# Altium schematic sheet SYSTEM_INTERFACE.SchDoc
size 594 x 420 mm; SheetNumber: 19; SheetTotal: 20
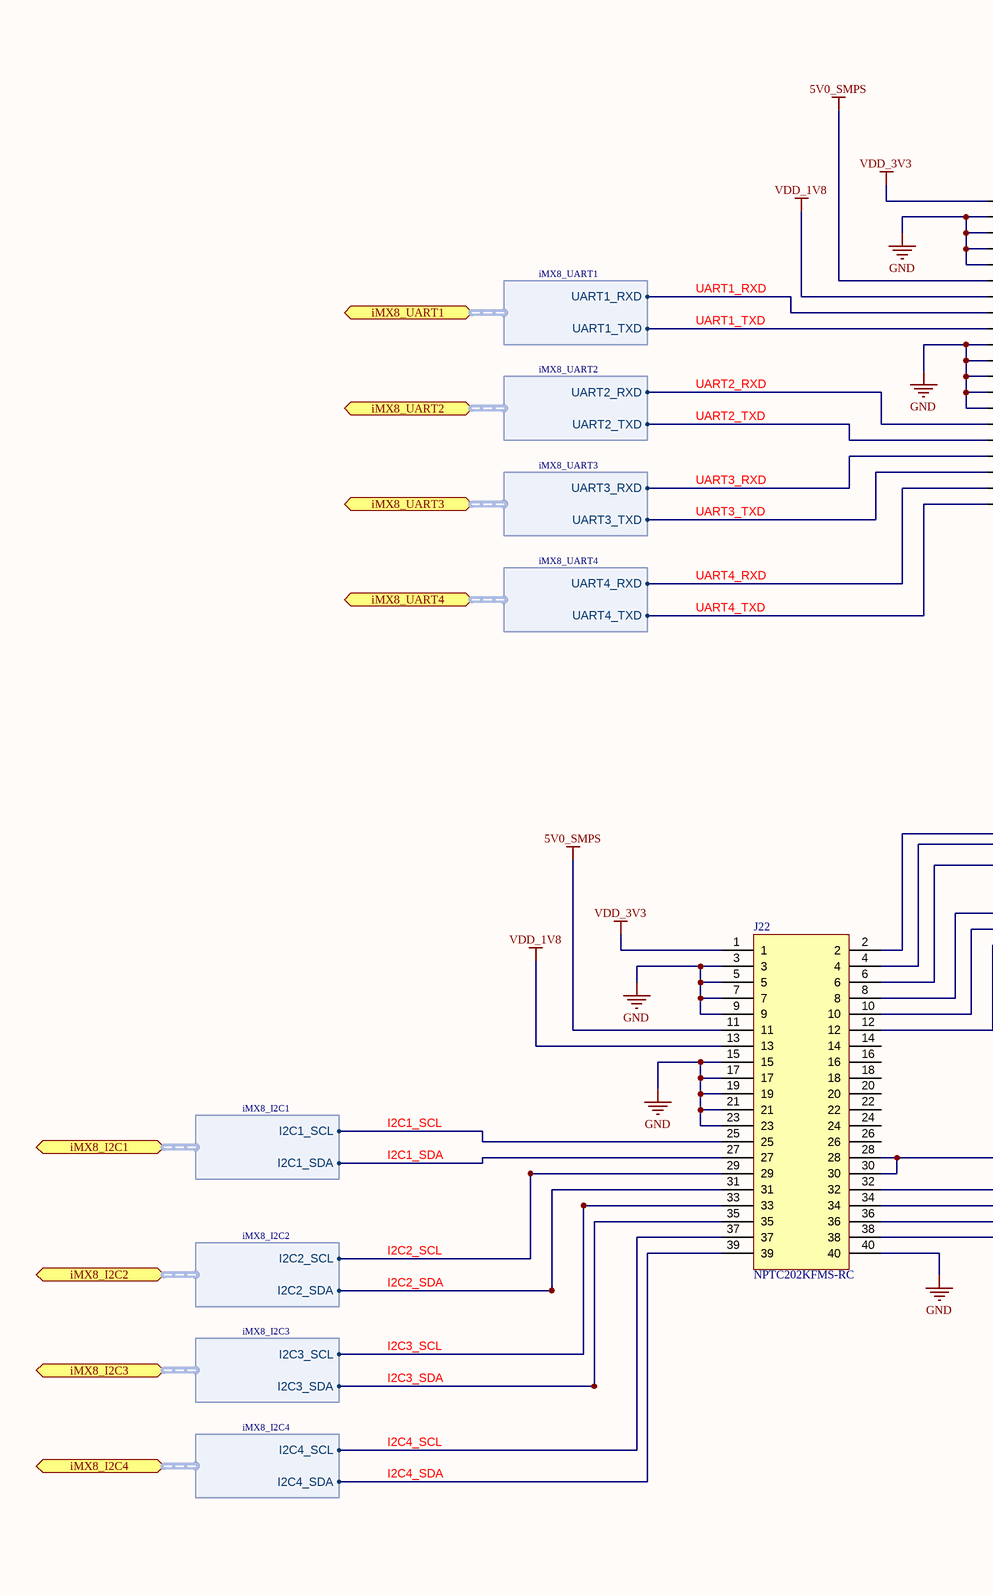
[diagram p0: SYSTEM_INTERFACE.SchDoc, left]
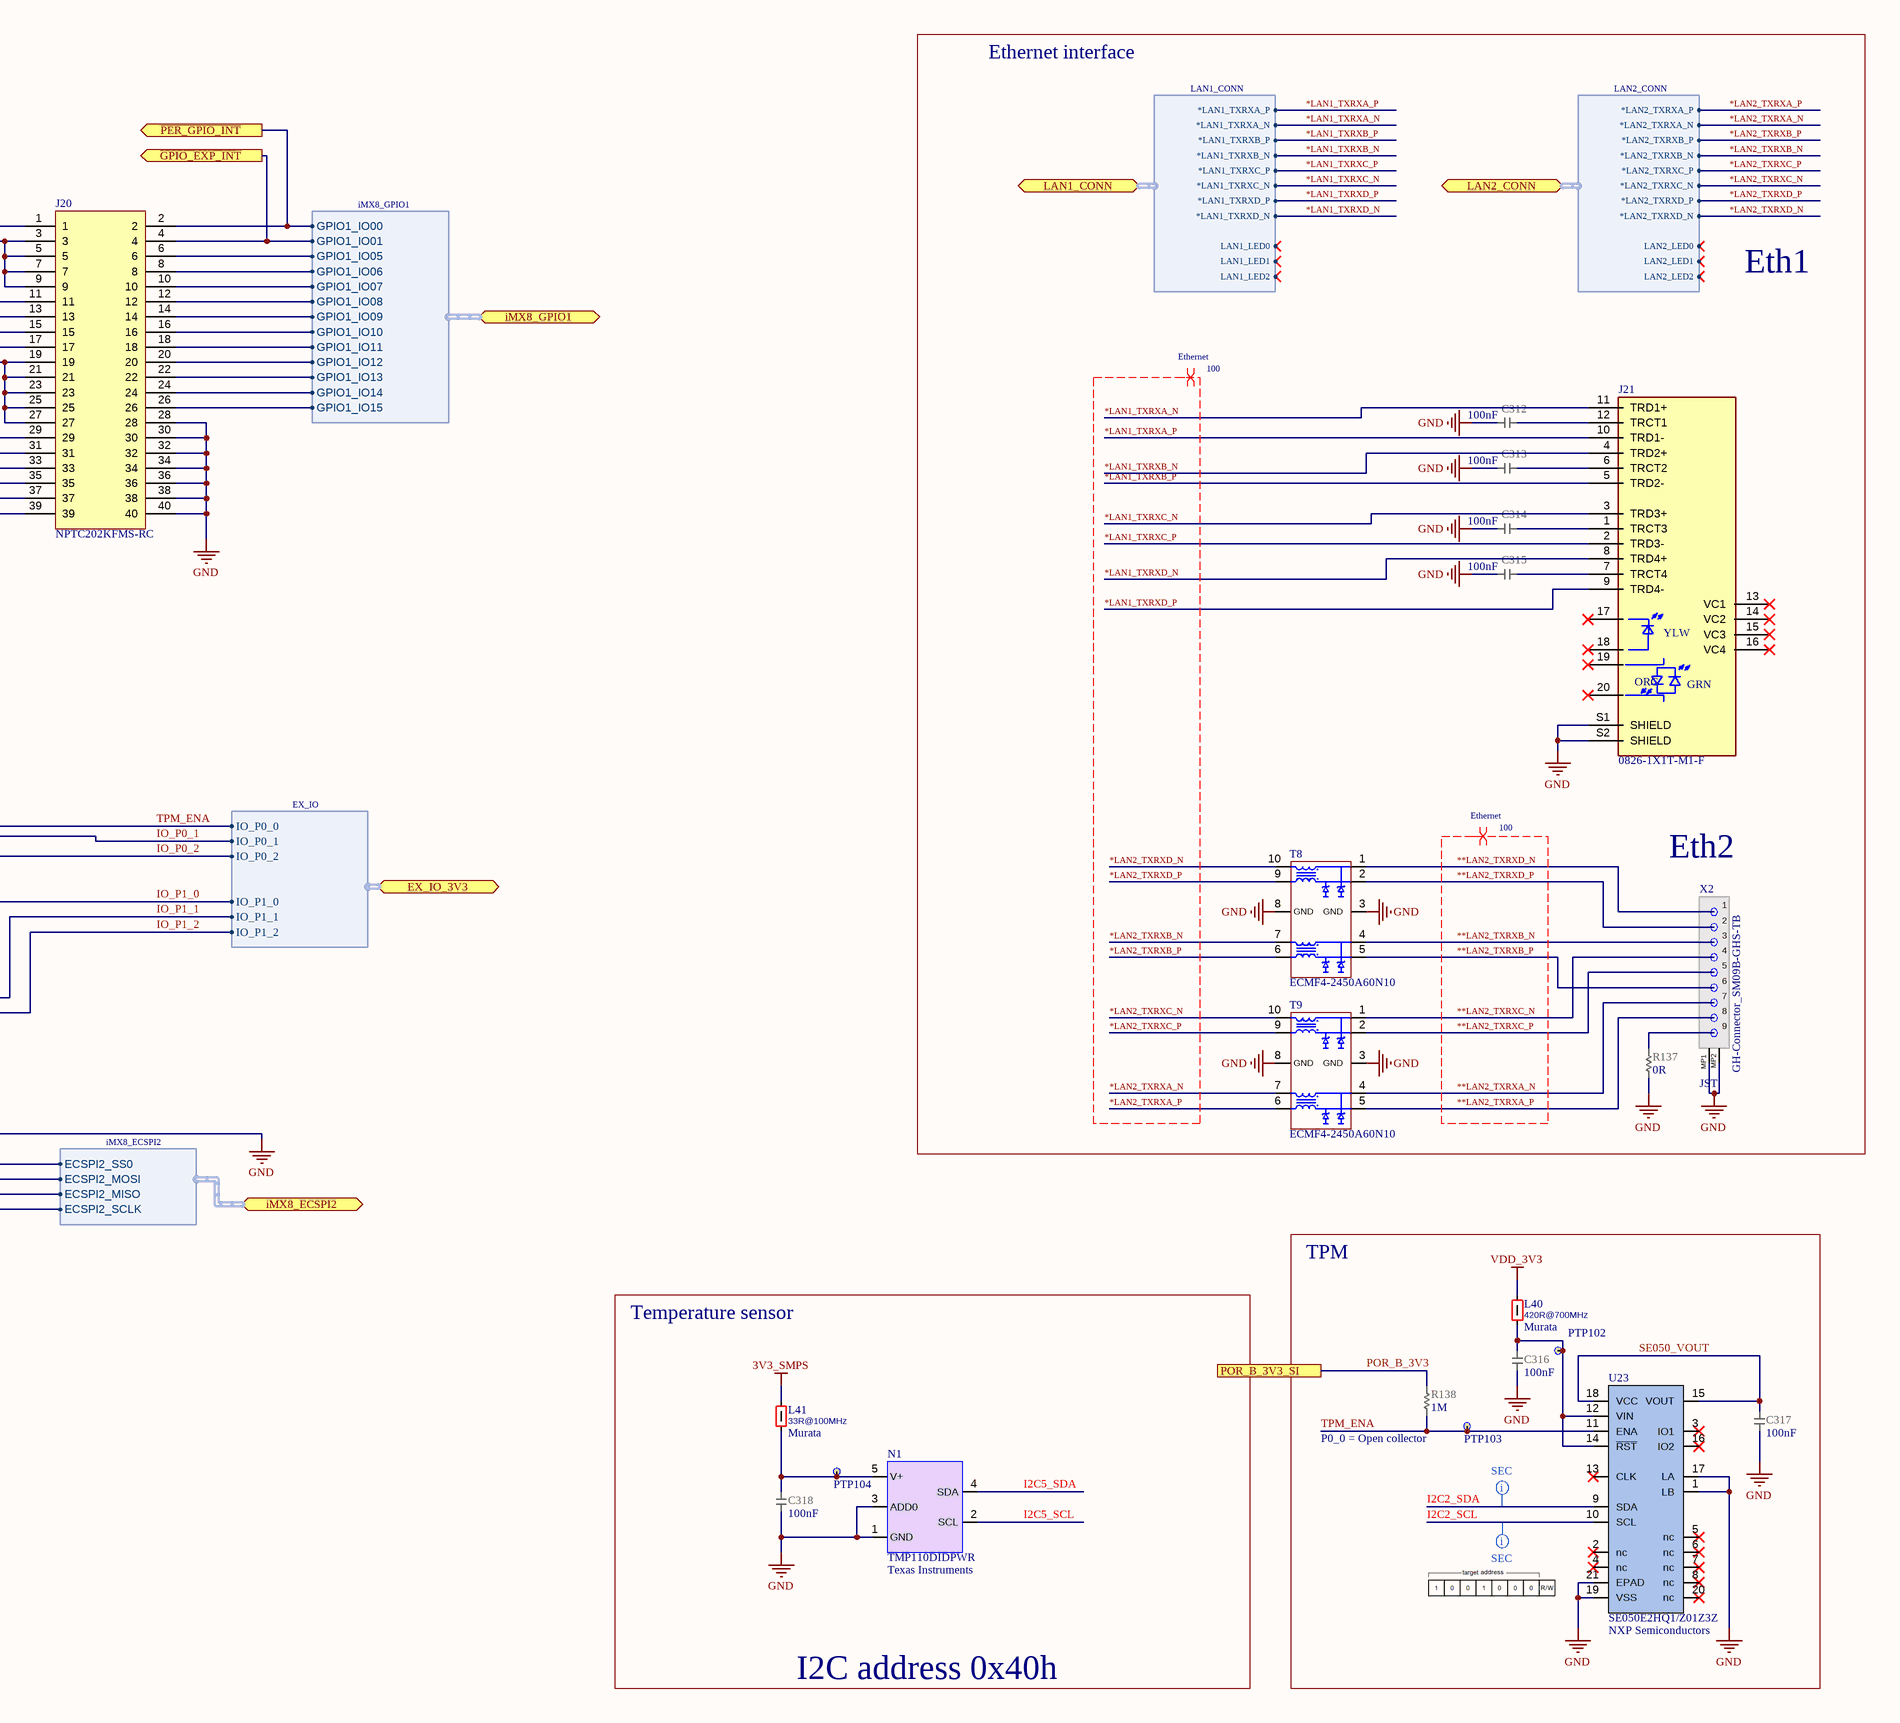
[diagram p1: SYSTEM_INTERFACE.SchDoc, right]

## Parts
C312  value 100nF  [CAP_0201_UN1Q]  (hidden comment: CAP_0201_100n_X7S_16V)
C313  value 100nF  [CAP_0201_UN1Q]  (hidden comment: CAP_0201_100n_X7S_16V)
C314  value 100nF  [CAP_0201_UN1Q]  (hidden comment: CAP_0201_100n_X7S_16V)
C315  value 100nF  [CAP_0201_UN1Q]  (hidden comment: CAP_0201_100n_X7S_16V)
C316  value 100nF  [CAP_0201_UN1Q]  (hidden comment: CAP_0201_100n_X7S_16V)
C317  value 100nF  [CAP_0201_UN1Q]  (hidden comment: CAP_0201_100n_X7S_16V)
C318  value 100nF  [CAP_0201_UN1Q]  (hidden comment: CAP_0201_100n_X7S_16V)
J20  NPTC202KFMS-RC  [SULLINS_NPTC202KFMS-RC]
J21  0826-1X1T-M1-F  [BEL_0826-1X1T-M1-F]
J22  NPTC202KFMS-RC  [SULLINS_NPTC202KFMS-RC]
L40  value 420R@700MHz  Manufacturer: Murata  [IND_0201_UN1Q]  (hidden comment: FERRITE_0201_BLF_700MHz_420Ohm)
L41  value 33R@100MHz  Manufacturer: Murata  [IND_0201_UN1Q]  (hidden comment: FERRITE_0201_BLM03_33Ohm)
N1  Manufacturer: Texas Instruments  [X2SON_DPW0005B]  (hidden comment: TMP110DIDPWR)
PTP102  PTP_0.4mm  [PTP_0.4mm]  (value not drawn)  (no BOM)
PTP103  PTP_0.4mm  [PTP_0.4mm]  (value not drawn)  (no BOM)
PTP104  PTP_0.4mm  [PTP_0.4mm]  (value not drawn)  (no BOM)
R137  value 0R  [RES_0201_UN1Q]  (hidden comment: RES_0201_0R)
R138  value 1M  [RES_0201_UN1Q]  (hidden comment: RES_0201_1M)
T8  EMI_ESD_ECMF4-2450A60N10  [ECMF4-2450A60N10]  (value not drawn)
T9  EMI_ESD_ECMF4-2450A60N10  [ECMF4-2450A60N10]  (value not drawn)
U23  Manufacturer: NXP Semiconductors  [HX2QFN20_NXP]  (hidden comment: SE050E2HQ1/Z01Z3Z)
X2  GH-Connector_SM09B-GHS-TB  Manufacturer: JST  [SM09B-GHS-TB]

## Blocks framed on the sheet
TPM: C316 C317 L40 PTP102 PTP103 R138 U23
I2C address 0x40h: C318 L41 N1 PTP104

## Ports
EX_IO_3V3 (bidir, harness EX_IO), iMX8_ECSPI2 (bidir, harness iMX8_ECSPI2), iMX8_GPIO1 (bidir, harness iMX8_GPIO1), iMX8_I2C1 (bidir, harness iMX8_I2C1), iMX8_I2C2 (bidir, harness iMX8_I2C2), iMX8_I2C3 (bidir, harness iMX8_I2C3), iMX8_I2C4 (bidir, harness iMX8_I2C4), iMX8_UART1 (bidir, harness iMX8_UART1), iMX8_UART2 (bidir, harness iMX8_UART2), iMX8_UART3 (bidir, harness iMX8_UART3), iMX8_UART4 (bidir, harness iMX8_UART4), LAN1_CONN (bidir, harness LAN1_CONN), LAN2_CONN (bidir, harness LAN2_CONN), POR_B_3V3_SI, ~{GPIO_EXP_INT} (out), ~{PER_GPIO_INT} (out)

## Harnesses
LAN2_CONN: LAN2_LED0, LAN2_LED1, LAN2_LED2, *LAN2_TXRXA_P, *LAN2_TXRXA_N, *LAN2_TXRXB_P, *LAN2_TXRXB_N, *LAN2_TXRXC_P, *LAN2_TXRXC_N, *LAN2_TXRXD_P, *LAN2_TXRXD_N
LAN1_CONN: LAN1_LED0, LAN1_LED1, LAN1_LED2, *LAN1_TXRXA_P, *LAN1_TXRXA_N, *LAN1_TXRXB_P, *LAN1_TXRXB_N, *LAN1_TXRXC_P, *LAN1_TXRXC_N, *LAN1_TXRXD_P, *LAN1_TXRXD_N
iMX8_GPIO1: GPIO1_IO00, GPIO1_IO01, GPIO1_IO05, GPIO1_IO06, GPIO1_IO07, GPIO1_IO08, GPIO1_IO09, GPIO1_IO10, GPIO1_IO11, GPIO1_IO12, GPIO1_IO13, GPIO1_IO14, GPIO1_IO15
iMX8_UART1: UART1_RXD, UART1_TXD
iMX8_UART2: UART2_RXD, UART2_TXD
iMX8_UART3: UART3_RXD, UART3_TXD
iMX8_UART4: UART4_RXD, UART4_TXD
iMX8_I2C1: I2C1_SCL, I2C1_SDA
iMX8_I2C2: I2C2_SCL, I2C2_SDA
iMX8_I2C3: I2C3_SCL, I2C3_SDA
iMX8_I2C4: I2C4_SCL, I2C4_SDA
iMX8_ECSPI2: ECSPI2_SS0, ECSPI2_MOSI, ECSPI2_MISO, ECSPI2_SCLK
EX_IO: IO_P0_2, IO_P1_1, IO_P0_1, IO_P0_0, IO_P1_2, IO_P1_0

## Nets
3V3_SMPS: L41.2
5V0_SMPS: J20.11 J22.11
GND: C312.1 C313.1 C314.1 C315.1 C316.2 C317.1 C318.2 J20.3 J20.5 J20.7 J20.9 J20.19 J20.21 J20.23 J20.25 J20.27 J20.28 J20.30 J20.32 J20.34 J20.36 J20.38 J20.40 J21.S1(SHIELD) J21.S2(SHIELD) J22.3 J22.5 J22.7 J22.9 J22.15 J22.17 J22.19 J22.21 J22.23 J22.28 J22.30 J22.40 N1.1(GND) N1.3(ADD0) R137.2 T8.3(GND) T8.8(GND) T9.3(GND) T9.8(GND) U23.1(LB) U23.17(LA) U23.19(VSS) U23.21(EPAD) X2.MP1 X2.MP2
VDD_1V8: J20.13 J22.13
VDD_3V3: J20.1 J22.1 L40.2
**LAN2_TXRXA_N: T9.4(D2+) X2.7
**LAN2_TXRXA_P: T9.5(D2-) X2.8
**LAN2_TXRXB_N: T8.4(D2+) X2.3
**LAN2_TXRXB_P: T8.5(D2-) X2.6
**LAN2_TXRXC_N: T9.1(D1+) X2.4
**LAN2_TXRXC_P: T9.2(D1-) X2.5
**LAN2_TXRXD_N: T8.1(D1+) X2.1
**LAN2_TXRXD_P: T8.2(D1-) X2.2
*LAN1_TXRXA_N: J21.11(TRD1+) ; port LAN1_CONN.*LAN1_TXRXA_N
*LAN1_TXRXA_P: J21.10(TRD1-) ; port LAN1_CONN.*LAN1_TXRXA_P
*LAN1_TXRXB_N: J21.4(TRD2+) ; port LAN1_CONN.*LAN1_TXRXB_N
*LAN1_TXRXB_P: J21.5(TRD2-) ; port LAN1_CONN.*LAN1_TXRXB_P
*LAN1_TXRXC_N: J21.3(TRD3+) ; port LAN1_CONN.*LAN1_TXRXC_N
*LAN1_TXRXC_P: J21.2(TRD3-) ; port LAN1_CONN.*LAN1_TXRXC_P
*LAN1_TXRXD_N: J21.8(TRD4+) ; port LAN1_CONN.*LAN1_TXRXD_N
*LAN1_TXRXD_P: J21.9(TRD4-) ; port LAN1_CONN.*LAN1_TXRXD_P
*LAN2_TXRXA_N: T9.7(D2+_IC) ; port LAN2_CONN.*LAN2_TXRXA_N
*LAN2_TXRXA_P: T9.6(D2-_IC) ; port LAN2_CONN.*LAN2_TXRXA_P
*LAN2_TXRXB_N: T8.7(D2+_IC) ; port LAN2_CONN.*LAN2_TXRXB_N
*LAN2_TXRXB_P: T8.6(D2-_IC) ; port LAN2_CONN.*LAN2_TXRXB_P
*LAN2_TXRXC_N: T9.10(D1+_IC) ; port LAN2_CONN.*LAN2_TXRXC_N
*LAN2_TXRXC_P: T9.9(D1-_IC) ; port LAN2_CONN.*LAN2_TXRXC_P
*LAN2_TXRXD_N: T8.10(D1+_IC) ; port LAN2_CONN.*LAN2_TXRXD_N
*LAN2_TXRXD_P: T8.9(D1-_IC) ; port LAN2_CONN.*LAN2_TXRXD_P
~{GPIO_EXP_INT}: J20.4 ; port ~{GPIO_EXP_INT}, port iMX8_GPIO1.GPIO1_IO01
~{PER_GPIO_INT}: J20.2 ; port ~{PER_GPIO_INT}, port iMX8_GPIO1.GPIO1_IO00
I2C1_SCL: J22.25 ; port iMX8_I2C1.I2C1_SCL
I2C1_SDA: J22.27 ; port iMX8_I2C1.I2C1_SDA
I2C2_SCL: J22.29 U23.10(SCL) ; port iMX8_I2C2.I2C2_SCL
I2C2_SDA: J22.31 U23.9(SDA) ; port iMX8_I2C2.I2C2_SDA
I2C3_SCL: J22.33 ; port iMX8_I2C3.I2C3_SCL
I2C3_SDA: J22.35 ; port iMX8_I2C3.I2C3_SDA
I2C4_SCL: J22.37 ; port iMX8_I2C4.I2C4_SCL
I2C4_SDA: J22.39 ; port iMX8_I2C4.I2C4_SDA
I2C5_SCL: N1.2(SCL)
I2C5_SDA: N1.4(SDA)
IO_P0_1: J22.4 ; port EX_IO_3V3.IO_P0_1
IO_P0_2: J22.6 ; port EX_IO_3V3.IO_P0_2
IO_P1_0: J22.8 ; port EX_IO_3V3.IO_P1_0
IO_P1_1: J22.10 ; port EX_IO_3V3.IO_P1_1
IO_P1_2: J22.12 ; port EX_IO_3V3.IO_P1_2
POR_B_3V3: R138.2 ; port POR_B_3V3_SI
SE050_VOUT: C317.2 U23.15(VOUT) U23.18(VCC)
TPM_ENA: J22.2 PTP103.1(TP) R138.1 U23.11(ENA) ; port EX_IO_3V3.IO_P0_0
UART1_RXD: J20.15 ; port iMX8_UART1.UART1_RXD
UART1_TXD: J20.17 ; port iMX8_UART1.UART1_TXD
UART2_RXD: J20.29 ; port iMX8_UART2.UART2_RXD
UART2_TXD: J20.31 ; port iMX8_UART2.UART2_TXD
UART3_RXD: J20.33 ; port iMX8_UART3.UART3_RXD
UART3_TXD: J20.35 ; port iMX8_UART3.UART3_TXD
UART4_RXD: J20.37 ; port iMX8_UART4.UART4_RXD
UART4_TXD: J20.39 ; port iMX8_UART4.UART4_TXD
NetC312_2: C312.2 J21.12(TRCT1)
NetC313_2: C313.2 J21.6(TRCT2)
NetC314_2: C314.2 J21.1(TRCT3)
NetC315_2: C315.2 J21.7(TRCT4)
NetC316_1: C316.1 L40.1 PTP102.1(TP) U23.12(VIN) U23.14(~{RST})
NetC318_1: C318.1 L41.1 N1.5(V+) PTP104.1(TP)
NetJ20_6: J20.6 ; port iMX8_GPIO1.GPIO1_IO05
NetJ20_8: J20.8 ; port iMX8_GPIO1.GPIO1_IO06
NetJ20_10: J20.10 ; port iMX8_GPIO1.GPIO1_IO07
NetJ20_12: J20.12 ; port iMX8_GPIO1.GPIO1_IO08
NetJ20_14: J20.14 ; port iMX8_GPIO1.GPIO1_IO09
NetJ20_16: J20.16 ; port iMX8_GPIO1.GPIO1_IO10
NetJ20_18: J20.18 ; port iMX8_GPIO1.GPIO1_IO11
NetJ20_20: J20.20 ; port iMX8_GPIO1.GPIO1_IO12
NetJ20_22: J20.22 ; port iMX8_GPIO1.GPIO1_IO13
NetJ20_24: J20.24 ; port iMX8_GPIO1.GPIO1_IO14
NetJ20_26: J20.26 ; port iMX8_GPIO1.GPIO1_IO15
NetJ22_32: J22.32 ; port iMX8_ECSPI2.ECSPI2_SS0
NetJ22_34: J22.34 ; port iMX8_ECSPI2.ECSPI2_MOSI
NetJ22_36: J22.36 ; port iMX8_ECSPI2.ECSPI2_MISO
NetJ22_38: J22.38 ; port iMX8_ECSPI2.ECSPI2_SCLK
NetR137_1: R137.1 X2.9

Not connected (* = marked no-connect by the designer): J21 13(VC1)* 14(VC2)* 15(VC3)* 16(VC4)* 17* 18* 19* 20*; J22 14 16 18 20 22 24 26; U23 2(nc)* 3(IO1)* 4(nc)* 5(nc)* 6(nc)* 7(nc)* 8(nc)* 13(CLK)* 16(IO2)* 20(nc)*

## Layout directives
differential pair; net class Ethernet; differential pair class 100; rule Matched Net Lengths [Tolerance = 0.4mm]: **LAN2_TXRXA_N, **LAN2_TXRXA_P, **LAN2_TXRXB_N, **LAN2_TXRXB_P, **LAN2_TXRXC_N, **LAN2_TXRXC_P, **LAN2_TXRXD_N, **LAN2_TXRXD_P, *LAN1_TXRXA_N, *LAN1_TXRXA_P, *LAN1_TXRXB_N, *LAN1_TXRXB_P, *LAN1_TXRXC_N, *LAN1_TXRXC_P, *LAN1_TXRXD_N, *LAN1_TXRXD_P, *LAN2_TXRXA_N, *LAN2_TXRXA_P, *LAN2_TXRXB_N, *LAN2_TXRXB_P, *LAN2_TXRXC_N, *LAN2_TXRXC_P, *LAN2_TXRXD_N, *LAN2_TXRXD_P
net class SEC: I2C2_SCL, I2C2_SDA

## Notes on the sheet
- Ethernet interface
- Eth1
- (near X2) Eth2
- Temperature sensor
- P0_0 = Open collector
- DWG NO:
- REV:
- THIS DOCUMENT AND THE DATA DISCLOSED HEREIN OR
- HEREWITH IS THE PROPERTY OF ALTIUM LIMITED AND MAY
- BE FREELY DISTRIBUTED IN WHOLE. NO RIGHTS ARE
- RESERVED OR EXPRESS OR IMPLIED WARANTEE GIVEN.
- REVISION
- DESCRIPTION
- DATE
- APPROVED
- ENG:
- APPROVALS
- PROJECT
- DSN:
- CHK:
- REFERENCE DOCUMENTS
- PROJECT REVISION:
- TITLE
- DOCUMENT REVISION:
- DESIGN ITEM:
- BOM:
- FAB DWG:
- PCB DWG:
- ASSY DWG:
- SCALE:
- A2
- SIZE
- CAGE CODE
- FILE NAME
- DWG NO.
- SHEET
- OF
- REV
- (in symbol 0826-1X1T-M1-F) YLW; ORG; GRN

## Library data of the parts
C312-C318 = CMP-001-000385-16: CAP; Part Number: GRM033C71C104KE14D; Manufacturer: Murata; Temperature characteristics: X7S; Tolerance: +/-10%; Sort order: 302; HasBeenBuilt: TBD; Alternative component: Allowed; Voltage: 16V; System: RLC; Package: 0201; ClassName: SMALL; ComponentLink1Description: 1_Datasheet; ComponentLink2Description: 2_Product page; ComponentLink3Description: 3_X-information; ComponentLink4Description: 4_X-information; Creation date: 20190101; Source: RLC_UN1Q.SchLib; Manufacturer Part Number: GRM033C71C104KE14D; Component Type: Capacitor
J20 J22 = NPTC202KFMS-RC: MF: {'manufacturer': u'Sullins Connector Solutions'}; Package: None; Price: None; Value: *; MP: NPTC202KFMS-RC; Availability: Unavailable
J21 = 0826-1X1T-M1-F: MagJack 1000BASE-T | PoE | 1X1 | OG/Y | Tab Up | RoHS; MF: Bel Magnetic Solutions; Package: None; MP: 0826-1X1T-M1-F; Availability: Unavailable; Price: None; Value: *; SnapEDA_Link: https://www.snapeda.com/parts/0826-1X1T-M1-F/Bel%20Magnetic%20Solutions/view-part/2753104/?ref=snap
L40 = CMP-001-000747-7: FERRITE; Part Number: BLF03JD421GZE; Manufacturer Part Number: BLF03JD421GZED; Tolerance: 25%; Sort order: 362; HasBeenBuilt: False; System: Discrete; Package: 0201; Operating temperature range: -55 ... +125C; ComponentLink1Description: 1_Datasheet; ComponentLink2Description: 2_Product page; ComponentLink3Description: 3_X-information; ComponentLink4Description: 4_X-information; Creation date: 20200304; ClassName: SMALL; Source: Discrete_UN1Q.SchLib; Component Type: Ferrite
L41 = CMP-001-000744-8: FERRITE; Part Number: BLM03PG330SN1; Manufacturer Part Number: BLM03PG330SN1D; Tolerance: 25%; Sort order: 362; HasBeenBuilt: TBD; System: Discrete; Current: 750mA; Package: 0201; Operating temperature range: -55 ... +125C; ClassName: SMALL; ComponentLink1Description: 1_Datasheet; ComponentLink1URL: https://www.murata.com/en-us/products/productdetail.aspx?cate=luNoiseSupprFilteChipFerriBead&partno=BLM03PG330SN1%23; ComponentLink2Description: 2_Product page; ComponentLink3Description: 3_X-information; ComponentLink4Description: 4_X-information; Creation date: 20200304; Source: Discrete_UN1Q.SchLib; Component Type: Ferrite
N1 = CMP-001-001548-1: I2C temperature sensor, X2SON-5; Sort order: 445; System: IC; ComponentLink2Description: 2_Product page; ComponentLink3Description: 3_X-information; Part Number: TMP110DIDPWR; ComponentLink1URL: https://www.ti.com/lit/ds/symlink/tmp110.pdf; Creation date: 20250911; ComponentLink1Description: 1_Datasheet; ClassName: BIG; Package: X2SON-5; ComponentLink4Description: 4_X-information; Dimensions WxLxH: 0.8 × 0.8 × 0.4mm; Manufacturer Part Number: TMP110DIDPWR; Component Type: Sensor
PTP102-PTP104 = CMP-001-001296-3: Production Testpoint 0.4mm. Flying probe. Use 1mm pitch.; Part Number: PTP 0.4mm; ComponentLink4Description: 4_X-information; ComponentLink1Description: 1_Datasheet; Sort order: -; ClassName: SMALL; System: Test Point; HasBeenBuilt: -; Design Item ID: PTP_0.4mm; ComponentLink3Description: 3_X-information; Creation date: 20240909; ComponentLink2Description: 2_Product page; Component Type: Test Point
R137 = CMP-001-000429-13: RES; Part Number: RC0201JR-070RL; Manufacturer: YAGEO; Manufacturer: Yageo Group; Tolerance: 5%; Sort order: 322; HasBeenBuilt: TBD; Alternative component: Allowed; System: RLC; Power Rating: 1/20W; Package: 0201; ComponentLink1Description: 1_Datasheet; ComponentLink2Description: 2_Product page; ComponentLink3Description: 3_X-information; ComponentLink4Description: 4_X-information; Creation date: 20190101; ClassName: SMALL; Source: RLC_UN1Q.SchLib; Manufacturer Part Number: RC0201JR-070RL; Component Type: Resistor
R138 = CMP-001-000431-12: RES; Manufacturer: Yageo; Part Number: RC0201FR-071ML; Sort order: 322; System: RLC; Tolerance: 1%; HasBeenBuilt: TBD; Alternative component: Allowed; Power Rating: 1/20W; ComponentLink1Description: 1_Datasheet; ClassName: SMALL; ComponentLink2Description: 2_Product page; Creation date: 20190101; Package: 0201; ComponentLink4Description: 4_X-information; Source: RLC_UN1Q.SchLib; ComponentLink3Description: 3_X-information
T8 T9 = CMP-001-001620-1: EMI Filter with ESD, 2x differential pair; Manufacturer: STMicroelectronics; System: Discrete; Sort order: 441; ComponentLink3Description: 3_X-information; Operating temperature range: -55°C ~ 125°C; Part Number: ECMF4-2450A60N10; Package: 10-XFDFN; ComponentLink1URL: https://www.st.com/resource/en/datasheet/ecmf4-2450a60n10.pdf; ComponentLink2Description: 2_Product page; Creation date: 20251103; ComponentLink2URL: https://www.st.com/en/protections-and-emi-filters/common-mode-filters-with-integrated-esd-protection-ecmf.html; ComponentLink1Description: 1_Datasheet; ComponentLink4Description: 4_X-information; Dimensions WxLxH: 2.20 x 1.35 x 0.50mm; Manufacturer Part Number: ECMF4-2450A60N10; Component Type: ESD & EMI
U23 = CMP-001-001414-1: TPM; Manufacturer: NXP USA Inc.; Sort order: 501; System: IC; ComponentLink1Description: 1_Datasheet; ComponentLink1URL: https://www.nxp.com/part/SE050E2HQ1; ComponentLink2Description: 2_Product page; ComponentLink2URL: https://www.nxp.com/products/security-and-authentication/authentication/edgelock-se050-plug-trust-secure-element-family-enhanced-iot-security-with-high-flexibility:SE050; ComponentLink3Description: 3_X-information; ComponentLink3URL: https://www.nxp.com/docs/en/package-information/SOT1969-1.pdf; Creation date: 20250528; Dimensions WxLxH: 3 x 3 x  0.33mm; Operating temperature range: -40°C .... +105°C; Package: HX2QFN20; Part Number: SE050E2HQ1/Z01Z3Z; ComponentLink4Description: 4_X-information; ComponentLink4URL: https://www.nxp.com/products/SE050; Manufacturer Part Number: SE050E2HQ1/Z01Z3Z; Component Type: Integrated Circuit
X2 = CMP-001-000097-10: JST GH Connector, Header, 9 pin, Horizontal, Pitch 1.25 mm; Manufacturer Part Number: SM09B-GHS-TB(LF)(SN); Sort order: 111; HasBeenBuilt: False; Part Number: SM09B-GHS-TB; ClassName: BIG; Operating temperature range: -25 ... +85 °C; ComponentLink1Description: 1_Datasheet; ComponentLink1URL: https://www.jst-mfg.com/product/pdf/eng/eGH.pdf; ComponentLink2Description: 2_Product page; ComponentLink3Description: 3_X-information; ComponentLink4Description: 4_X-information; Creation date: 20210708; Dimensions WxLxH: 4.05x14.5x4.25; System: Connector; Design Item ID: GH-Connector_SM09B-GHS-TB; Source: Conn_UN1Q.SchLib; Component Type: Connector